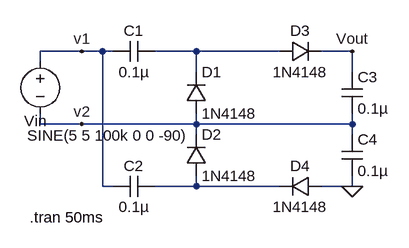
[diagram p0: schematic Stage2.Fullwave_Voltage_Quadrupler.asc]
Stage2.Fullwave_Voltage_Quadrupler.asc, the LTspice schematic file:
Version 4
SHEET 1 880 680
WIRE 0 48 -64 48
WIRE 32 48 0 48
WIRE 48 48 32 48
WIRE 176 48 112 48
WIRE 304 48 176 48
WIRE 416 48 368 48
WIRE -64 64 -64 48
WIRE 176 80 176 48
WIRE 416 80 416 48
WIRE -64 160 -64 144
WIRE 0 160 -64 160
WIRE 176 160 176 144
WIRE 176 160 0 160
WIRE 416 160 416 144
WIRE 416 160 176 160
WIRE 176 176 176 160
WIRE 416 176 416 160
WIRE 32 256 32 48
WIRE 48 256 32 256
WIRE 176 256 176 240
WIRE 176 256 112 256
WIRE 304 256 176 256
WIRE 416 256 416 240
WIRE 416 256 368 256
FLAG 416 256 0
FLAG 416 48 Vout
FLAG 0 48 v1
FLAG 0 160 v2
SYMBOL voltage -64 48 R0
WINDOW 123 0 0 Left 0
WINDOW 39 0 0 Left 0
WINDOW 3 -20 130 Left 2
WINDOW 0 -25 107 Left 2
SYMATTR Value SINE(5 5 100k 0 0 -90)
SYMATTR InstName Vin
SYMBOL diode 160 144 M180
WINDOW 0 24 64 Left 2
WINDOW 3 24 0 Left 2
SYMATTR InstName D1
SYMATTR Value 1N4148
SYMBOL cap 112 32 R90
WINDOW 0 0 32 VBottom 2
WINDOW 3 32 32 VTop 2
SYMATTR InstName C1
SYMATTR Value 0.1µ
SYMBOL diode 160 240 M180
WINDOW 0 24 64 Left 2
WINDOW 3 24 0 Left 2
SYMATTR InstName D2
SYMATTR Value 1N4148
SYMBOL diode 304 32 M90
WINDOW 0 0 32 VBottom 2
WINDOW 3 32 32 VTop 2
SYMATTR InstName D3
SYMATTR Value 1N4148
SYMBOL diode 368 272 M270
WINDOW 0 32 32 VTop 2
WINDOW 3 0 32 VBottom 2
SYMATTR InstName D4
SYMATTR Value 1N4148
SYMBOL cap 112 240 R90
WINDOW 0 0 32 VBottom 2
WINDOW 3 32 32 VTop 2
SYMATTR InstName C2
SYMATTR Value 0.1µ
SYMBOL cap 400 80 R0
SYMATTR InstName C3
SYMATTR Value 0.1µ
SYMBOL cap 400 176 R0
SYMATTR InstName C4
SYMATTR Value 0.1µ
TEXT -80 304 Left 2 !.tran 50ms

The netlist it stands for:
* Stage2.Fullwave_Voltage_Quadrupler.asc
Vin v1 v2 SINE(5 5 100k 0 0 -90)
D1 v2 N001 1N4148
C1 N001 v1 0.1µ
D2 N002 v2 1N4148
D3 N001 Vout 1N4148
D4 0 N002 1N4148
C2 N002 v1 0.1µ
C3 Vout v2 0.1µ
C4 v2 0 0.1µ
.model D D
.lib standard.dio
.tran 50ms
.backanno
.end